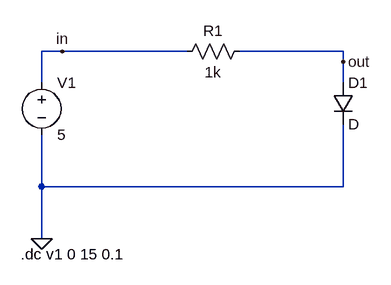
[diagram p0: schematic Diode_ideal.asc]
Diode_ideal.asc, the LTspice schematic file:
Version 4.1
SHEET 1 880 680
WIRE -48 16 -80 16
WIRE 144 16 -48 16
WIRE 384 16 224 16
WIRE 384 32 384 16
WIRE -80 64 -80 16
WIRE 384 64 384 32
WIRE -80 224 -80 144
WIRE 384 224 384 128
WIRE 384 224 -80 224
WIRE -80 304 -80 224
FLAG -80 304 0
FLAG -48 16 in
FLAG 384 32 out
SYMBOL voltage -80 48 R0
SYMATTR InstName V1
SYMATTR Value 5
SYMBOL res 240 0 R90
WINDOW 0 0 56 VBottom 2
WINDOW 3 32 56 VTop 2
SYMATTR InstName R1
SYMATTR Value 1k
SYMBOL diode 368 64 R0
SYMATTR InstName D1
TEXT -112 328 Left 2 !.dc v1 0 15 0.1

The netlist it stands for:
* Diode_ideal.asc
V1 in 0 5
R1 out in 1k
D1 out 0 D
.model D D
.lib standard.dio
.dc v1 0 15 0.1
.backanno
.end

* Results of the author's LTspice run, read from the files saved beside the schematic
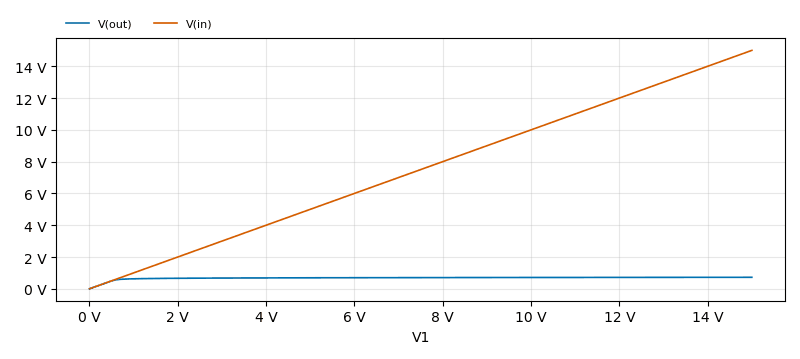
[diagram p1: DC transfer characteristic of Diode_ideal.asc, plotted from the saved traces]
* DC transfer characteristic, 1 run:
*   V(out): 0 V at V1=0 V, 723.9 mV at V1=15 V, min 0 V, max 723.9 mV
*   V(in): 0 V at V1=0 V, 15 V at V1=15 V, min 0 V, max 15 V